# Altium schematic sheet USBhub.SchDoc
size 558 x 431 mm; SheetNumber: 1; SheetTotal: 1
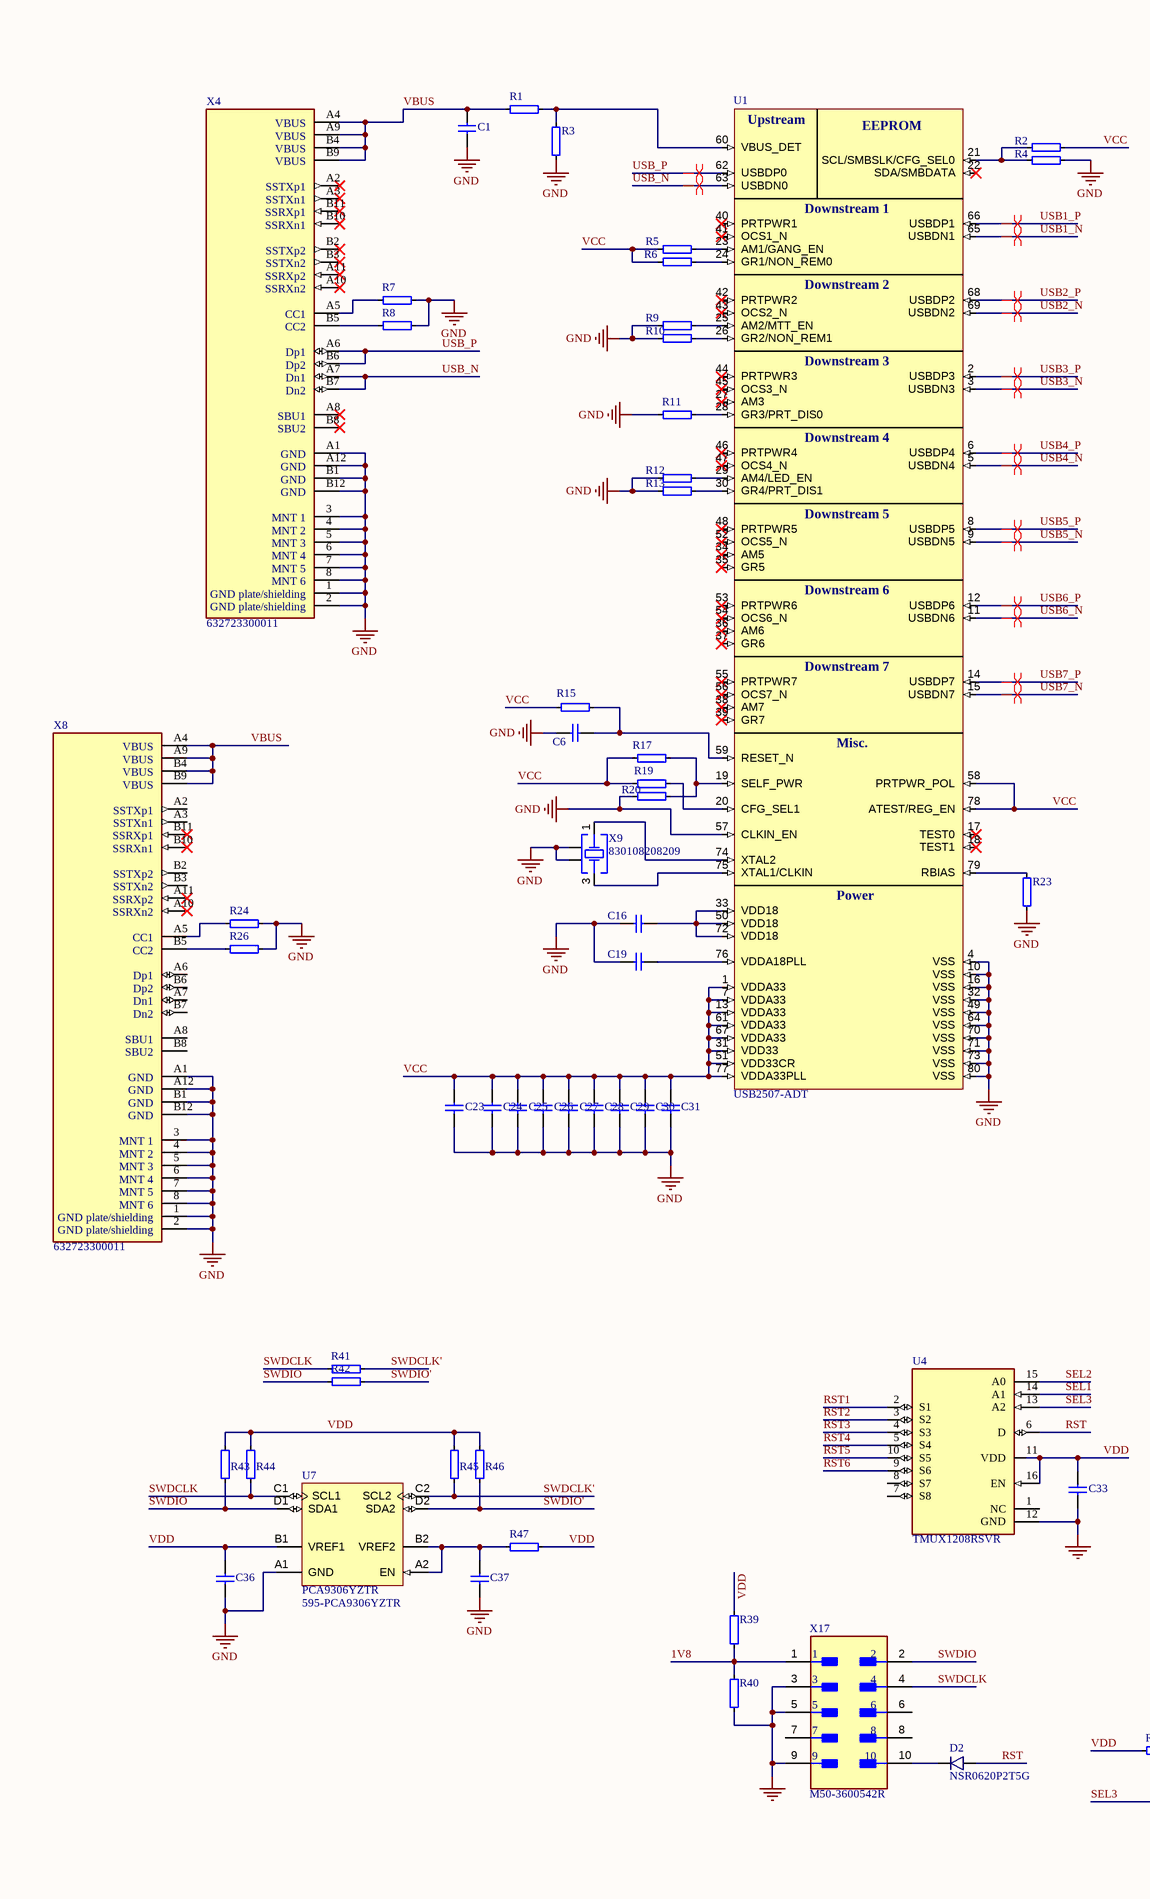
[diagram p0: USBhub.SchDoc, left]
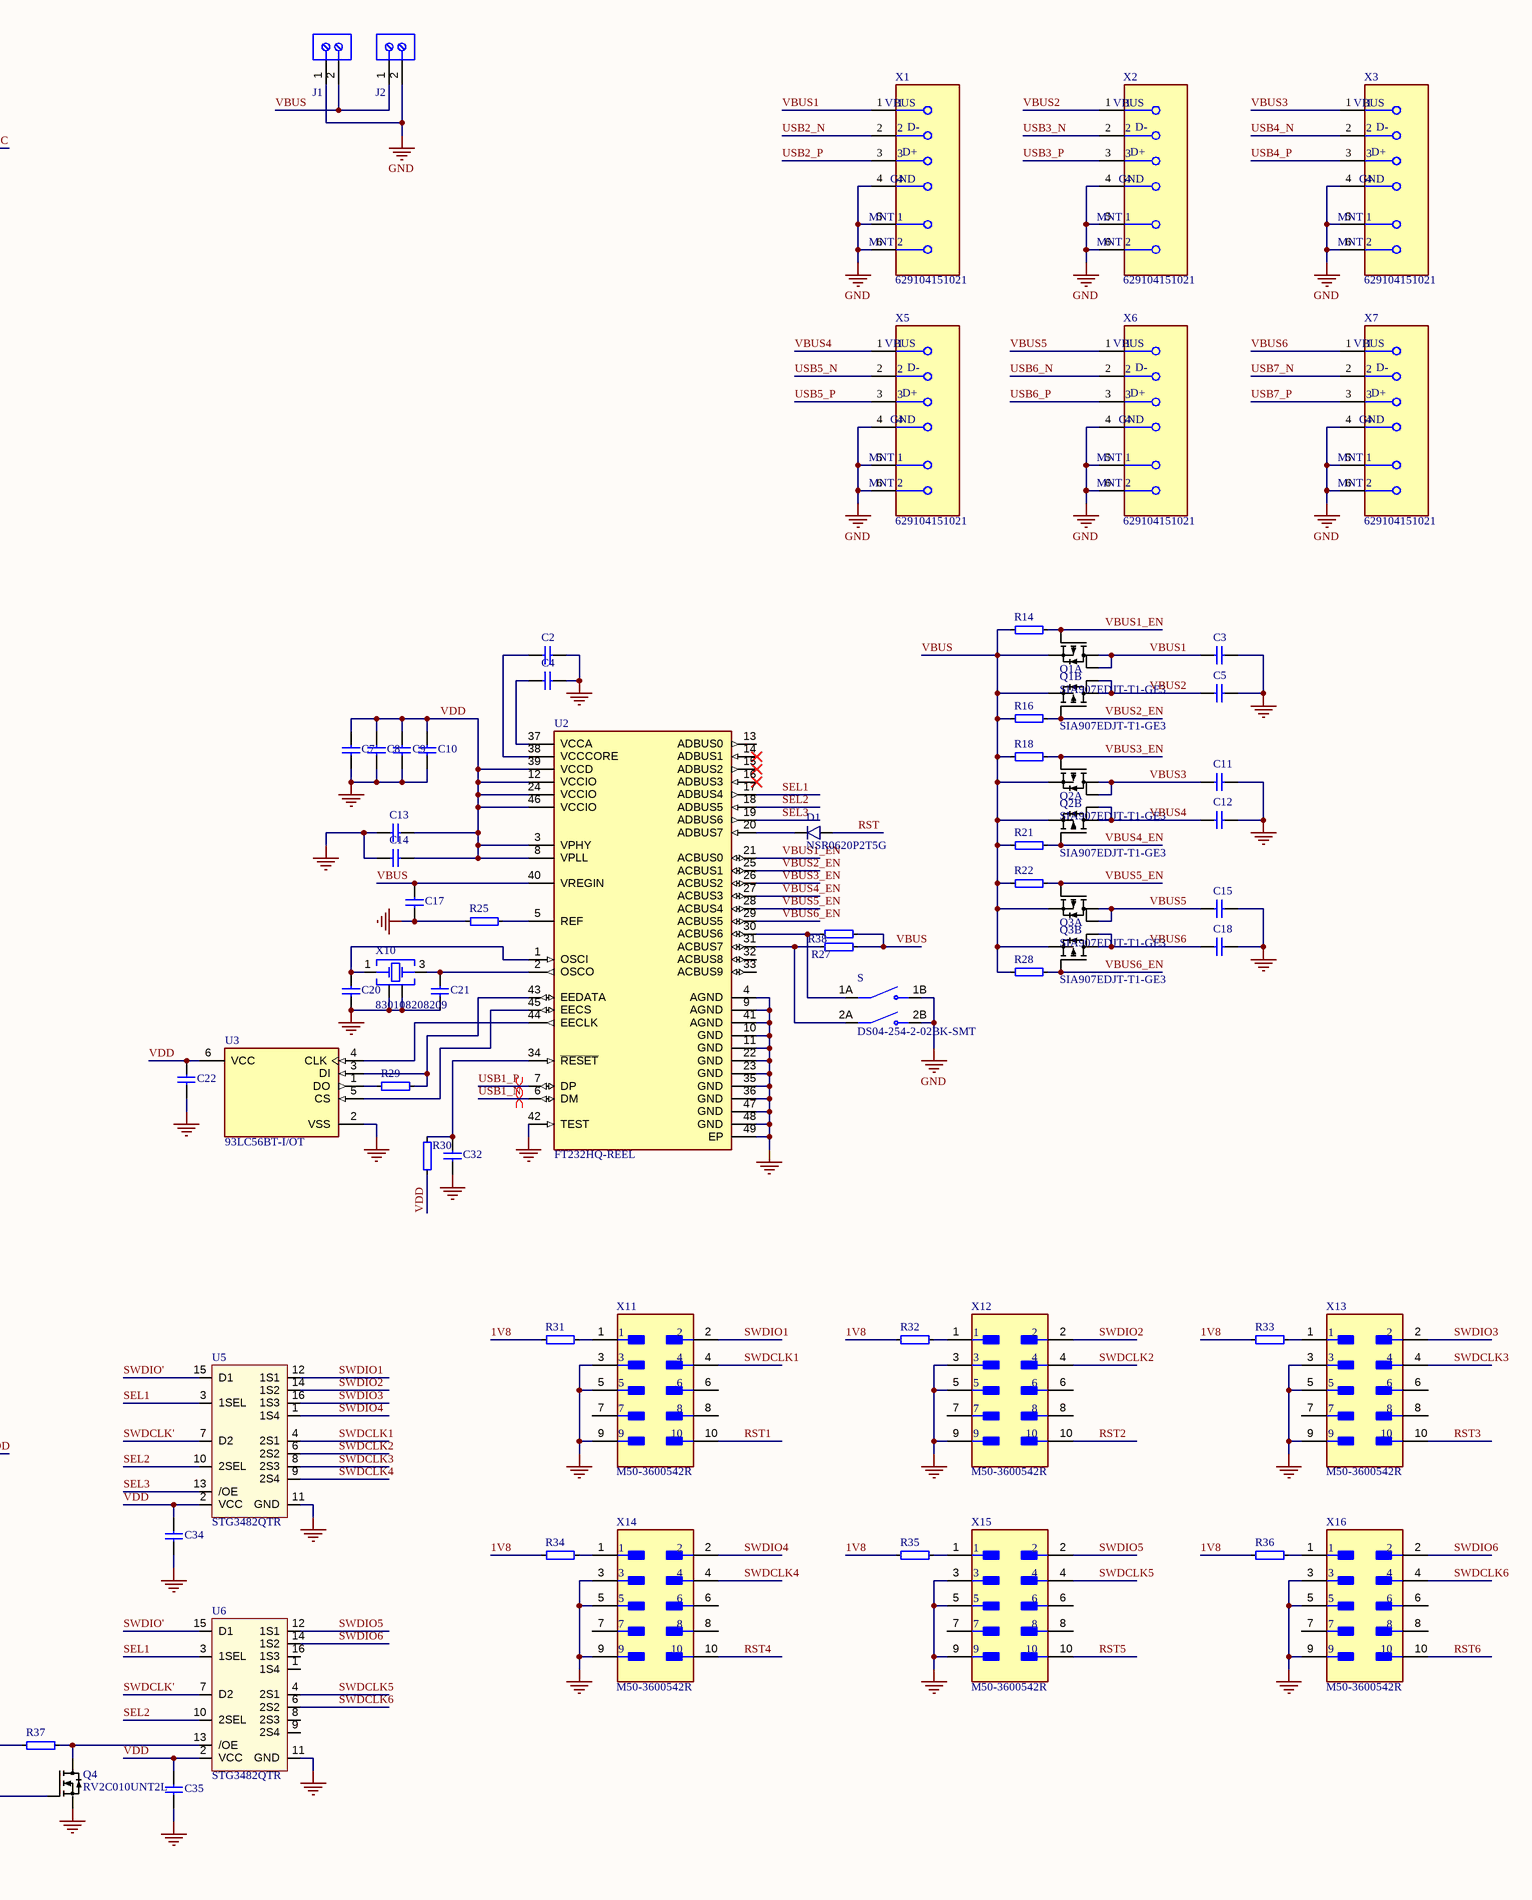
[diagram p1: USBhub.SchDoc, right]

## Parts
C1  C0402  [CAPC1005X04L]  (value not drawn)
C2  C0201  [CAPC0603X03L_C]  (value not drawn)
C3  C0402  [CAPC1005X04L]  (value not drawn)
C4  C0201  [CAPC0603X03L_C]  (value not drawn)
C5  C0402  [CAPC1005X04L]  (value not drawn)
C6  C0201  [CAPC0603X03L_C]  (value not drawn)
C7  C0201  [CAPC0603X03L_C]  (value not drawn)
C8  C0201  [CAPC0603X03L_C]  (value not drawn)
C9  C0201  [CAPC0603X03L_C]  (value not drawn)
C10  C0201  [CAPC0603X03L_C]  (value not drawn)
C11  C0402  [CAPC1005X04L]  (value not drawn)
C12  C0402  [CAPC1005X04L]  (value not drawn)
C13  C0201  [CAPC0603X03L_C]  (value not drawn)
C14  C0201  [CAPC0603X03L_C]  (value not drawn)
C15  C0402  [CAPC1005X04L]  (value not drawn)
C16  C0402  [CAPC1005X04L]  (value not drawn)
C17  C0201  [CAPC0603X03L_C]  (value not drawn)
C18  C0402  [CAPC1005X04L]  (value not drawn)
C19  C0402  [CAPC1005X04L]  (value not drawn)
C20  C0201  [CAPC0603X03L_C]  (value not drawn)
C21  C0201  [CAPC0603X03L_C]  (value not drawn)
C22  C0201  [CAPC0603X03L_C]  (value not drawn)
C23  C0603  [CAPC1608X06L]  (value not drawn)
C24  C0201  [CAPC0603X03L_C]  (value not drawn)
C25  C0201  [CAPC0603X03L_C]  (value not drawn)
C26  C0201  [CAPC0603X03L_C]  (value not drawn)
C27  C0201  [CAPC0603X03L_C]  (value not drawn)
C28  C0201  [CAPC0603X03L_C]  (value not drawn)
C29  C0201  [CAPC0603X03L_C]  (value not drawn)
C30  C0201  [CAPC0603X03L_C]  (value not drawn)
C31  C0201  [CAPC0603X03L_C]  (value not drawn)
C32  C0201  [CAPC0603X03L_C]  (value not drawn)
C33  C0201  [CAPC0603X03L_C]  (value not drawn)
C34  C0201  [CAPC0603X03L_C]  (value not drawn)
C35  C0201  [CAPC0603X03L_C]  (value not drawn)
C36  C0201  [CAPC0603X03L_C]  (value not drawn)
C37  C0201  [CAPC0603X03L_C]  (value not drawn)
D1  NSR0620P2T5G  [SODFL100X40-2N]
D2  NSR0620P2T5G  [SODFL100X40-2N]
J1  691103110002  [691103110002]  (value not drawn)
J2  691103110002  [691103110002]  (value not drawn)
Q1  SIA907EDJT-T1-GE3  [FP-C-07431-DUAL-MFG]  (parts A,B of 2)
Q2  SIA907EDJT-T1-GE3  [FP-C-07431-DUAL-MFG]  (parts A,B of 2)
Q3  SIA907EDJT-T1-GE3  [FP-C-07431-DUAL-MFG]  (parts A,B of 2)
Q4  RV2C010UNT2L  [DFN65P100X40-3L]
R1  R0201  [RESC0603X03L_C]  (value not drawn)
R2  R0201  [RESC0603X03L_C]  (value not drawn)
R3  R0201  [RESC0603X03L_C]  (value not drawn)
R4  R0201  [RESC0603X03L_C]  (value not drawn)
R5  R0201  [RESC0603X03L_C]  (value not drawn)
R6  R0201  [RESC0603X03L_C]  (value not drawn)
R7  R0201  [RESC0603X03L_C]  (value not drawn)
R8  R0201  [RESC0603X03L_C]  (value not drawn)
R9  R0201  [RESC0603X03L_C]  (value not drawn)
R10  R0201  [RESC0603X03L_C]  (value not drawn)
R11  R0201  [RESC0603X03L_C]  (value not drawn)
R12  R0201  [RESC0603X03L_C]  (value not drawn)
R13  R0201  [RESC0603X03L_C]  (value not drawn)
R14  R0201  [RESC0603X03L_C]  (value not drawn)
R15  R0201  [RESC0603X03L_C]  (value not drawn)
R16  R0201  [RESC0603X03L_C]  (value not drawn)
R17  R0201  [RESC0603X03L_C]  (value not drawn)
R18  R0201  [RESC0603X03L_C]  (value not drawn)
R19  R0201  [RESC0603X03L_C]  (value not drawn)
R20  R0201  [RESC0603X03L_C]  (value not drawn)
R21  R0201  [RESC0603X03L_C]  (value not drawn)
R22  R0201  [RESC0603X03L_C]  (value not drawn)
R23  R0201  [RESC0603X03L_C]  (value not drawn)
R24  R0201  [RESC0603X03L_C]  (value not drawn)
R25  R0201  [RESC0603X03L_C]  (value not drawn)
R26  R0201  [RESC0603X03L_C]  (value not drawn)
R27  R0201  [RESC0603X03L_C]  (value not drawn)
R28  R0201  [RESC0603X03L_C]  (value not drawn)
R29  R0201  [RESC0603X03L_C]  (value not drawn)
R30  R0201  [RESC0603X03L_C]  (value not drawn)
R31  R0201  [RESC0603X03L_C]  (value not drawn)
R32  R0201  [RESC0603X03L_C]  (value not drawn)
R33  R0201  [RESC0603X03L_C]  (value not drawn)
R34  R0201  [RESC0603X03L_C]  (value not drawn)
R35  R0201  [RESC0603X03L_C]  (value not drawn)
R36  R0201  [RESC0603X03L_C]  (value not drawn)
R37  R0201  [RESC0603X03L_C]  (value not drawn)
R38  R0201  [RESC0603X03L_C]  (value not drawn)
R39  R0201  [RESC0603X03L_C]  (value not drawn)
R40  R0201  [RESC0603X03L_C]  (value not drawn)
R41  R0201  [RESC0603X03L_C]  (value not drawn)
R42  R0201  [RESC0603X03L_C]  (value not drawn)
R43  R0201  [RESC0603X03L_C]  (value not drawn)
R44  R0201  [RESC0603X03L_C]  (value not drawn)
R45  R0201  [RESC0603X03L_C]  (value not drawn)
R46  R0201  [RESC0603X03L_C]  (value not drawn)
R47  R0201  [RESC0603X03L_C]  (value not drawn)
S  DS04-254-2-02BK-SMT  [SW_DS04-254-2-02BK-SMT]
U1  USB2507-ADT  [USB2507-ADT]
U2  FT232HQ-REEL  [FT232HQ]
U3  93LC56BT-I/OT  [93LC56BT-I/OT_sot23-6]
U4  TMUX1208RSVR  [FP-RSV0016A-MFG]
U5  STG3482QTR  [STG3482QTR]
U6  STG3482QTR  [STG3482QTR]
U7  PCA9306YZTR  Supplier Part Number 1: 595-PCA9306YZTR  [PCA9306YZTR]
X1  629104151021  [FP-629104151021-MFG]
X2  629104151021  [FP-629104151021-MFG]
X3  629104151021  [FP-629104151021-MFG]
X4  632723300011  [FP-632723300011-MFG]
X5  629104151021  [FP-629104151021-MFG]
X6  629104151021  [FP-629104151021-MFG]
X7  629104151021  [FP-629104151021-MFG]
X8  632723300011  [FP-632723300011-MFG]
X9  830108208209  [WE-XTAL_CFPX-218]
X10  830108208209  [WE-XTAL_CFPX-218]
X11  M50-3600542R  [M50-3600542R]
X12  M50-3600542R  [M50-3600542R]
X13  M50-3600542R  [M50-3600542R]
X14  M50-3600542R  [M50-3600542R]
X15  M50-3600542R  [M50-3600542R]
X16  M50-3600542R  [M50-3600542R]
X17  M50-3600542R  [M50-3600542R]

## Nets
GND: C1.1 C2.1 C3.1 C4.1 C5.1 C6.1 C7.1 C8.1 C9.1 C10.1 C11.1 C12.1 C13.2 C14.2 C15.1 C16.1 C17.1 C18.1 C19.1 C20.2 C21.2 C22.1 C23.1 C24.1 C25.1 C26.1 C27.1 C28.1 C29.1 C30.1 C31.1 C32.1 C33.1 C34.1 C35.1 C36.1 C37.1 J1.1 J2.2 Q4.2(S) R3.2 R4.2 R7.1 R8.1 R9.1 R10.1 R11.1 R12.1 R13.1 R20.1 R23.2 R24.1 R25.1 R26.1 R40.2 S.1B(NO1) S.2B(NO2) U1.4(VSS) U1.10(VSS) U1.16(VSS) U1.32(VSS) U1.49(VSS) U1.57(CLKIN_EN) U1.64(VSS) U1.70(VSS) U1.71(VSS) U1.73(VSS) U1.80(VSS) U2.4(AGND) U2.9(AGND) U2.10(GND) U2.11(GND) U2.22(GND) U2.23(GND) U2.35(GND) U2.36(GND) U2.41(AGND) U2.42(TEST) U2.47(GND) U2.48(GND) U2.49(EP) U3.2(VSS) U4.12(GND) U5.11(GND) U6.11(GND) U7.A1(GND) X1.4 X1.5(MNT_1) X1.6(MNT_2) X2.4 X2.5(MNT_1) X2.6(MNT_2) X3.4 X3.5(MNT_1) X3.6(MNT_2) X4.1(GND_plate/shielding) X4.2(GND_plate/shielding) X4.3(MNT_1) X4.4(MNT_2) X4.5(MNT_3) X4.6(MNT_4) X4.7(MNT_5) X4.8(MNT_6) X4.A1(GND) X4.A12(GND) X4.B1(GND) X4.B12(GND) X5.4 X5.5(MNT_1) X5.6(MNT_2) X6.4 X6.5(MNT_1) X6.6(MNT_2) X7.4 X7.5(MNT_1) X7.6(MNT_2) X8.1(GND_plate/shielding) X8.2(GND_plate/shielding) X8.3(MNT_1) X8.4(MNT_2) X8.5(MNT_3) X8.6(MNT_4) X8.7(MNT_5) X8.8(MNT_6) X8.A1(GND) X8.A12(GND) X8.B1(GND) X8.B12(GND) X9.2(GND) X9.4(GND) X10.2(GND) X10.4(GND) X11.3 X11.5 X11.9 X12.3 X12.5 X12.9 X13.3 X13.5 X13.9 X14.3 X14.5 X14.9 X15.3 X15.5 X15.9 X16.3 X16.5 X16.9 X17.3 X17.5 X17.9
1V8: R31.2 R32.2 R33.2 R34.2 R35.2 R36.2 R39.2 R40.1 X17.1
RST: D1.2(A) D2.2(A) U4.6(D)
RST1: U4.2(S1) X11.10
RST2: U4.3(S2) X12.10
RST3: U4.4(S3) X13.10
RST4: U4.5(S4) X14.10
RST5: U4.10(S5) X15.10
RST6: U4.9(S6) X16.10
SEL1: U2.17(ADBUS4) U4.14(A1) U5.3(1SEL) U6.3(1SEL)
SEL2: U2.18(ADBUS5) U4.15(A0) U5.10(2SEL) U6.10(2SEL)
SEL3: Q4.1(G) U2.19(ADBUS6) U4.13(A2) U5.13(/OE)
SWDCLK: R41.2 R44.1 U7.C1(SCL1) X17.4
SWDCLK1: U5.4(2S1) X11.4
SWDCLK2: U5.6(2S2) X12.4
SWDCLK3: U5.8(2S3) X13.4
SWDCLK4: U5.9(2S4) X14.4
SWDCLK5: U6.4(2S1) X15.4
SWDCLK6: U6.6(2S2) X16.4
SWDCLK': R41.1 R45.1 U5.7(D2) U6.7(D2) U7.C2(SCL2)
SWDIO: R42.2 R43.1 U7.D1(SDA1) X17.2
SWDIO1: U5.12(1S1) X11.2
SWDIO2: U5.14(1S2) X12.2
SWDIO3: U5.16(1S3) X13.2
SWDIO4: U5.1(1S4) X14.2
SWDIO5: U6.12(1S1) X15.2
SWDIO6: U6.14(1S2) X16.2
SWDIO': R42.1 R46.1 U5.15(D1) U6.15(D1) U7.D2(SDA2)
USB1_N: U1.65(USBDN1) U2.6(DM)
USB1_P: U1.66(USBDP1) U2.7(DP)
USB2_N: U1.69(USBDN2) X1.2
USB2_P: U1.68(USBDP2) X1.3
USB3_N: U1.3(USBDN3) X2.2
USB3_P: U1.2(USBDP3) X2.3
USB4_N: U1.5(USBDN4) X3.2
USB4_P: U1.6(USBDP4) X3.3
USB5_N: U1.9(USBDN5) X5.2
USB5_P: U1.8(USBDP5) X5.3
USB6_N: U1.11(USBDN6) X6.2
USB6_P: U1.12(USBDP6) X6.3
USB7_N: U1.15(USBDN7) X7.2
USB7_P: U1.14(USBDP7) X7.3
USB_N: U1.63(USBDN0) X4.A7(Dn1) X4.B7(Dn2)
USB_P: U1.62(USBDP0) X4.A6(Dp1) X4.B6(Dp2)
VBUS: C1.2 C17.2 J1.2 J2.1 Q1.1(S1) Q1.4(S2) Q2.1(S1) Q2.4(S2) Q3.1(S1) Q3.4(S2) R1.2 R14.2 R16.2 R18.2 R21.2 R22.2 R27.2 R28.2 R38.2 U2.40(VREGIN) X4.A4(VBUS) X4.A9(VBUS) X4.B4(VBUS) X4.B9(VBUS) X8.A4(VBUS) X8.A9(VBUS) X8.B4(VBUS) X8.B9(VBUS)
VBUS1: C3.2 Q1.3(D2) Q1.8(D2) X1.1
VBUS1_EN: Q1.5(G2) R14.1 U2.21(ACBUS0)
VBUS2: C5.2 Q1.6(D1) Q1.7(D1) X2.1
VBUS2_EN: Q1.2(G1) R16.1 U2.25(ACBUS1)
VBUS3: C11.2 Q2.3(D2) Q2.8(D2) X3.1
VBUS3_EN: Q2.5(G2) R18.1 U2.26(ACBUS2)
VBUS4: C12.2 Q2.6(D1) Q2.7(D1) X5.1
VBUS4_EN: Q2.2(G1) R21.1 U2.27(ACBUS3)
VBUS5: C15.2 Q3.3(D2) Q3.8(D2) X6.1
VBUS5_EN: Q3.5(G2) R22.1 U2.28(ACBUS4)
VBUS6: C18.2 Q3.6(D1) Q3.7(D1) X7.1
VBUS6_EN: Q3.2(G1) R28.1 U2.29(ACBUS5)
VCC: C23.2 C24.2 C25.2 C26.2 C27.2 C28.2 C29.2 C30.2 C31.2 R2.2 R5.1 R6.1 R15.1 R17.1 R19.1 U1.1(VDDA33) U1.7(VDDA33) U1.13(VDDA33) U1.31(VDD33) U1.51(VDD33CR) U1.58(PRTPWR_POL) U1.61(VDDA33) U1.67(VDDA33) U1.77(VDDA33PLL) U1.78(ATEST/REG_EN)
VDD: C7.2 C8.2 C9.2 C10.2 C13.1 C14.1 C22.2 C33.2 C34.2 C35.2 C36.2 R30.1 R37.2 R39.1 R43.2 R44.2 R45.2 R46.2 R47.1 U2.3(VPHY) U2.8(VPLL) U2.12(VCCIO) U2.24(VCCIO) U2.39(VCCD) U2.46(VCCIO) U3.6(VCC) U4.11(VDD) U4.16(EN) U5.2(VCC) U6.2(VCC) U7.B1(VREF1)
NetC2_2: C2.2 U2.38(VCCCORE)
NetC4_2: C4.2 U2.37(VCCA)
NetC6_2: C6.2 R15.2 U1.59(RESET_N)
NetC16_2: C16.2 U1.33(VDD18) U1.50(VDD18) U1.72(VDD18)
NetC19_2: C19.2 U1.76(VDDA18PLL)
NetC20_1: C20.1 U2.1(OSCI) X10.1(Crystal)
NetC21_1: C21.1 U2.2(OSCO) X10.3(Crystal)
NetC32_2: C32.2 R30.2 U2.34(~{RESET})
NetC37_2: C37.2 R47.2 U7.A2(EN) U7.B2(VREF2)
NetD1_1: D1.1(C) U2.20(ADBUS7)
NetD2_1: D2.1(C) X17.10
NetQ4_3: Q4.3(D) R37.1 U6.13(/OE)
NetR1_1: R1.1 R3.1 U1.60(VBUS_DET)
NetR2_1: R2.1 R4.1 U1.21(SCL/SMBSLK/CFG_SEL0)
NetR5_2: R5.2 U1.23(AM1/GANG_EN)
NetR6_2: R6.2 U1.24(GR1/NON_REM0)
NetR7_2: R7.2 X4.A5(CC1)
NetR8_2: R8.2 X4.B5(CC2)
NetR9_2: R9.2 U1.25(AM2/MTT_EN)
NetR10_2: R10.2 U1.26(GR2/NON_REM1)
NetR11_2: R11.2 U1.28(GR3/PRT_DIS0)
NetR12_2: R12.2 U1.29(AM4/LED_EN)
NetR13_2: R13.2 U1.30(GR4/PRT_DIS1)
NetR17_2: R17.2 R20.2 U1.19(SELF_PWR)
NetR19_2: R19.2 U1.20(CFG_SEL1)
NetR23_1: R23.1 U1.79(RBIAS)
NetR24_2: R24.2 X8.A5(CC1)
NetR25_2: R25.2 U2.5(REF)
NetR26_2: R26.2 X8.B5(CC2)
NetR27_1: R27.1 S.2A(COM2) U2.31(ACBUS7)
NetR29_1: R29.1 U3.1(DO)
NetR29_2: R29.2 U2.43(EEDATA) U3.3(DI)
NetR31_1: R31.1 X11.1
NetR32_1: R32.1 X12.1
NetR33_1: R33.1 X13.1
NetR34_1: R34.1 X14.1
NetR35_1: R35.1 X15.1
NetR36_1: R36.1 X16.1
NetR38_1: R38.1 S.1A(COM1) U2.30(ACBUS6)
NetU1_74: U1.74(XTAL2) X9.1(Crystal)
NetU1_75: U1.75(XTAL1/CLKIN) X9.3(Crystal)
NetU2_44: U2.44(EECLK) U3.4(CLK)
NetU2_45: U2.45(EECS) U3.5(CS)

Not connected (* = marked no-connect by the designer): U1 17(TEST0)* 18(TEST1)* 22(SDA/SMBDATA)* 27(AM3)* 34(AM5)* 35(GR5)* 36(AM6)* 37(GR6)* 38(AM7)* 39(GR7)* 40(PRTPWR1)* 41(OCS1_N)* 42(PRTPWR2)* 43(OCS2_N)* 44(PRTPWR3)* 45(OCS3_N)* 46(PRTPWR4)* 47(OCS4_N)* 48(PRTPWR5)* 52(OCS5_N)* 53(PRTPWR6)* 54(OCS6_N)* 55(PRTPWR7)* 56(OCS7_N)*; U2 13(ADBUS0) 14(ADBUS1)* 15(ADBUS2)* 16(ADBUS3)* 32(ACBUS8) 33(ACBUS9); U4 1(NC) 7(S8) 8(S7); U6 1(1S4) 8(2S3) 9(2S4) 16(1S3); X4 A2(SSTXp1)* A3(SSTXn1)* A8(SBU1)* A10(SSRXn2)* A11(SSRXp2)* B2(SSTXp2)* B3(SSTXn2)* B8(SBU2)* B10(SSRXn1)* B11(SSRXp1)*; X8 A2(SSTXp1) A3(SSTXn1) A6(Dp1) A7(Dn1) A8(SBU1) A10(SSRXn2)* A11(SSRXp2)* B2(SSTXp2) B3(SSTXn2) B6(Dp2) B7(Dn2) B8(SBU2) B10(SSRXn1)* B11(SSRXp1)*; X11 6 7 8; X12 6 7 8; X13 6 7 8; X14 6 7 8; X15 6 7 8; X16 6 7 8; X17 6 7 8

## Layout directives
differential pair: USB1_N, USB1_P
differential pair; differential pair class usbDif: USB1_N, USB1_P, USB2_N, USB2_P, USB3_N, USB3_P, USB4_N, USB4_P, USB5_N, USB5_P, USB6_N, USB6_P, USB7_N, USB7_P, USB_N, USB_P

## Notes on the sheet
- DWG. NO.
- REV.
- SHT.
- REVISION
- DESCRIPTION
- DATE
- APPROVED
- THIS DOCUMENT AND THE DATA DISCLOSED HEREIN OR HEREWITH IS THE PROPERTY OF ALTIUM LIMITED AND MAY BE FREELY DISTRIBUTED IN WHOLE. NO RIGHTS ARE RESERVED OR EXPRESS OR IMPLIED WARANTEE GIVEN.
- ENG:
- DSN:
- APPROVALS
- PROJECT
- DOCUMENT REVISION:
- DESIGN ITEM:
- CHK:
- BOM:
- REFERENCE DOCUMENTS
- PROJECT REVISION:
- TITLE
- FAB DWG:
- PCB DWG:
- ASSY DWG:
- SCALE:
- SIZE
- C
- CAGE CODE
- FILE NAME
- DWG NO.
- SHEET
- OF
- REV
- (in symbol 629104151021) VBUS; D-; D+; GND
- (in symbol USB2507-ADT) Upstream; EEPROM; Downstream 1; Downstream 2; Downstream 3; Downstream 4; Downstream 5; Downstream 6; Downstream 7; Misc.; Power

## Library data of the parts
D1 D2 = NSR0620P2T5G: 20V schottky barrier diode, Vf 350 mV @ 100 mA, Ir 2.0 µA @ 10 V, If 500 mA; Manufacturer: ON Semiconductor; Part number IPS: 00000009952; Note: N.A.; Artikkelnr Noca: 10029169; Pad Count: 2; Part Number: NSR0620P2T5G; Manufacturer Part Number: NSR0620P2T5G; LatestRevisionDate: 2016-07-07; Published: 2016-07-07; Value: NSR0620P2T5G; Footprint Doc: SOD-923; ComponentLink1URL: N.A.; ComponentLink1Description: Datasheet; ComponentLink2URL: N.A.; ComponentLink2Description: Supplier link; HelpURL: http://www.onsemi.com/pub_link/Collateral/NSR0620P2-D.PDF; Supplier 1: Digi-Key; Supplier Part Number 1: NSR0620P2T5GOSCT-ND; Supplier 2: N.A.; Supplier Part Number 2: N.A.; Component Class: Semiconductors; PartId: 101300131
J1 J2 = 691103110002: WR-TBL Series 1031 Horizontal Entry Modular, Through Hole, pitch 3.5mm, 2p; Manufacturer: Wurth Elektronik; Pin Number: 2; Rated Current: 10A; Working Voltage: 125V; PCB/Cable/Panel: PCB; Modularity: Yes; ComponentLink1Description: Manufacturer Link; ComponentLink1URL: https://www.we-online.com/redexpert/article/691103110002?ad; ComponentLink2Description: Datasheet; ComponentLink2URL: https://www.we-online.com/redexpert/spec/691103110002?ad; Category: Terminal Blocks; Match Code: WR-TBL; Manufacturer Part Number: 691103110002; Mount: Through Hole; Operating Temperature Max: 105°C; Operating Temperature Min: -40°C; Packaging: Box; Pitch: 3.5mm; Orientation: Horizontal; Application: Pressure Clamp
Q1-Q3 = SIA907EDJT-T1-GE3: SiA907EDJT Series Dual P Channel 20 V 0.057 Ohm 7.8 W Mosfet - PowerPAK SC-70-6L; Manufacturer: Vishay Siliconix; Rds On Max: 57mR; Rise Time: 10ns; Drain to Source Voltage (Vdss): 20V; Continuous Drain Current (ID): 4.5A; Max Power Dissipation: 7.8W; Gate to Source Voltage (Vgs): 12V; Turn-Off Delay Time: 30ns; Number of Elements: 2; Power Dissipation: 1.9W; Turn-On Delay Time: 5ns; Drain to Source Breakdown Voltage: -20V; Polarity: P-CHANNEL; Supplier 1: Mouser; Manufacturer Part Number: SIA907EDJT-T1-GE3; RoHS: Yes; Category: MOSFETs; Stock 1: 2602; Pricing 1: 1=0.57000, 10=0.49500, 50=0.49500, 100=0.37000, 500=0.29100, 1000=0.22500, 3000=0.20400, 6000=0.19100, 9000=0.18500, 10000=0.18500 (USD); Mount: Surface Mount; Number of Pins: 6; Weight: 0.000988oz; Min Operating Temperature: -55°C; Max Operating Temperature: 150°C; Packaging: Tape and Reel; Package Quantity: 3000; Drain to Source Resistance: 57mR; Fall Time: 10ns; Number of Channels: 2; On-State Resistance: 57mR; Element Configuration: Dual; Series: TrenchFET®; Drain-source On Resistance-Max: 57mR; Radiation Hardening: No; Lead Free: Contains Lead; RoHS Compliant: Yes; ComponentLink1URL: https://datasheet.ciiva.com/4444/sia907edjt-223688-4444605.pdf?src-supplier=Mouser; ComponentLink1Description: https://datasheet.ciiva.com/4444/sia907edjt-223688-4444605.pdf?src-supplier=Mouser; ComponentLink2URL: https://datasheet.ciiva.com/30021/sia907edjt-30021591.pdf?src-supplier=Avnet; ComponentLink2Description: https://datasheet.ciiva.com/30021/sia907edjt-30021591.pdf?src-supplier=Avnet; Supplier Part Number 1: 78-SIA907EDJT-T1-GE3
Q4 = RV2C010UNT2L: MOSFET Transistor, N Channel, 1 A, 20 V, 0.34 ohm, 4.5 V, 1 V RoHS Compliant: Yes; Manufacturer: Rohm; Drain to Source Voltage (Vdss): 20V; Continuous Drain Current (ID): 1A; Rds On Max: 470mR; Input Capacitance: 40pF; Max Power Dissipation: 400mW; Threshold Voltage: 1V; Resistance: 0.34R; Supplier 1: Mouser; Manufacturer Part Number: RV2C010UNT2L; RoHS: Yes; Category: MOSFETs; Stock 1: 3031; Pricing 1: 1=0.39000, 10=0.25100, 50=0.25100, 100=0.16500, 500=0.10900, 1000=0.08400, 2500=0.07700, 10000=0.07700 (USD); Mount: Surface Mount; Number of Pins: 1006; Max Operating Temperature: 150°C; Packaging: Cut Tape; REACH SVHC: No SVHC; RoHS Compliant: Yes; ComponentLink1URL: http://www.farnell.com/datasheets/1945594.pdf?src-supplier=Farnell; ComponentLink1Description: http://www.farnell.com/datasheets/1945594.pdf?src-supplier=Farnell; ComponentLink2URL: http://www.mouser.com/ds/2/348/rv2c010un-e-1139137.pdf?src-supplier=Mouser; ComponentLink2Description: http://www.mouser.com/ds/2/348/rv2c010un-e-1139137.pdf?src-supplier=Mouser; ComponentLink3URL: http://rohmfs.rohm.com/en/techdata_basic/transistor/taping/VML1006_T2L_taping.pdf?src-supplier=Digi-Key; ComponentLink3Description: http://rohmfs.rohm.com/en/techdata_basic/transistor/taping/VML1006_T2L_taping.pdf?src-supplier=Digi-Key; ComponentLink4URL: http://www.rohm.com/web/global/datasheet/RV2C010UN/rv2c010un-e?src-supplier=Digi-Key; ComponentLink4Description: http://www.rohm.com/web/global/datasheet/RV2C010UN/rv2c010un-e?src-supplier=Digi-Key; ComponentLink5URL: http://rohmfs.rohm.com/en/products/databook/datasheet/discrete/transistor/mosfet/rv2c010unt2l.pdf?src-supplier=Avnet; ComponentLink5Description: http://rohmfs.rohm.com/en/products/databook/datasheet/discrete/transistor/mosfet/rv2c010unt2l.pdf?src-supplier=Avnet; ComponentLink6URL: http://www.farnell.com/datasheets/1945594.pdf?src-supplier=Element14; ComponentLink6Description: http://www.farnell.com/datasheets/1945594.pdf?src-supplier=Element14; Supplier Part Number 1: 755-RV2C010UNT2L
S = DS04-254-2-02BK-SMT: 2 Pole, Flat Actuator, Flat Bottom, SMT Pin, DIP Switch; MF: CUI Devices; SnapEDA_Link: https://www.snapeda.com/parts/DS04-254-2-02BK-SMT/CUI%20Devices/view-part/4467284/?ref=snap; Price: None; Value: *; Availability: Unavailable; Package: None; MP: DS04-254-2-02BK-SMT
U1 = USB2507-ADT: Low Speed/Full Speed/High Speed Compatible 7 Port Hub USB 2.0 1.8V/3.3V Tray 80-Pin TQFP; Manufacturer: Microchip; Data Rate: 480Mbps; Nominal Supply Current: 360mA; Min Supply Voltage: 3V; Max Supply Voltage: 3.6V; Number of Transceivers: 3; Interface: USB,I2C,Serial; Operating Supply Voltage: 3.3V; Operating Supply Current: 100mA; Number of Ports: 7; Supplier 1: Arrow Electronics; Manufacturer Part Number: USB2507-ADT; RoHS: Yes; Category: Integrated Circuits (ICs); Stock 1: 130; Pricing 1: 1=7.41290 (USD); Mount: Surface Mount; Case/Package: TQFP; Number of Pins: 80; Contact Plating: Tin,Matte; Min Operating Temperature: 0°C; Max Operating Temperature: 70°C; Packaging: Tray; Package Quantity: 119; Termination: SMD/SMT; Dual Supply Voltage: 3.3V; Number of Channels: 7; Series: -; Supply Current: 360mA; Length: 12mm; Width: 12mm; Height: 1.4mm; Radiation Hardening: No; Lead Free: Lead Free; REACH SVHC: No SVHC; RoHS Compliant: Yes; ComponentLink1URL: https://datasheet.ciiva.com/41459/001086006-da-01-en-ic-hub-7port-usb-usb2507-adt-tqfp-80-mcp-41459381.pdf?src-supplier=Conrad; ComponentLink1Description: https://datasheet.ciiva.com/41459/001086006-da-01-en-ic-hub-7port-usb-usb2507-adt-tqfp-80-mcp-41459381.pdf?src-supplier=Conrad; ComponentLink2URL: https://datasheet.ciiva.com/6636/2507-6636631.pdf?src-supplier=Digi-Key; ComponentLink2Description: https://datasheet.ciiva.com/6636/2507-6636631.pdf?src-supplier=Digi-Key; Supplier Part Number 1: USB2507-ADT
U2 = FT232HQ-REEL: Full Speed/High Speed USB Interface Device USB 2.0 3.3V T/R 48-Pin QFN EP; Manufacturer: FTDI; Data Rate: 12Mbps; Interface: UART; Number of Channels: 1; Max Supply Voltage: 3.63V; Min Supply Voltage: 2.97V; Nominal Supply Current: 60mA; Operating Supply Current: 24mA; Supplier 1: Mouser; Manufacturer Part Number: FT232HQ-REEL; RoHS: Yes; Category: Interface ICs; Pricing 1: 1=4.52000, 10=4.34000, 50=3.93000, 100=3.82000, 250=3.73000, 500=3.68000, 1000=3.56000, 6000=3.55000, 10000=3.09000 (USD); Mount: Surface Mount; Case/Package: QFN; Number of Pins: 48; Weight: 0.005309oz; Min Operating Temperature: -40°C; Max Operating Temperature: 85°C; Packaging: Tape and Reel; Package Quantity: 1; Operating Supply Voltage: 3.3V; Supply Current: 60mA; Series: -; Length: 7mm; Width: 7mm; Height: 1.4mm; Radiation Hardening: No; Lead Free: Lead Free; RoHS Compliant: Yes; REACH SVHC: No SVHC; ComponentLink1URL: https://datasheet.ciiva.com/4787/ds-ft232h-11324-4787568.pdf?src-supplier=Mouser; ComponentLink1Description: https://datasheet.ciiva.com/4787/ds-ft232h-11324-4787568.pdf?src-supplier=Mouser; ComponentLink2URL: https://datasheet.ciiva.com/7661/ds-ft232h-7661547.pdf?src-supplier=Element14; ComponentLink2Description: https://datasheet.ciiva.com/7661/ds-ft232h-7661547.pdf?src-supplier=Element14; ComponentLink3URL: https://datasheet.ciiva.com/1787/ds-ft232h-1787045.pdf?src-supplier=Digi-Key; ComponentLink3Description: https://datasheet.ciiva.com/1787/ds-ft232h-1787045.pdf?src-supplier=Digi-Key; ComponentLink4URL: https://datasheet.ciiva.com/1787/ds-ft232h-1787044.pdf?src-supplier=Digi-Key; ComponentLink4Description: https://datasheet.ciiva.com/1787/ds-ft232h-1787044.pdf?src-supplier=Digi-Key; ComponentLink5URL: https://datasheet.ciiva.com/1787/ds-ft232h-1787046.pdf?src-supplier=Digi-Key; ComponentLink5Description: https://datasheet.ciiva.com/1787/ds-ft232h-1787046.pdf?src-supplier=Digi-Key; Supplier Part Number 1: 895-FT232HQ-REEL
U3 = 93LC56BT-I/OT: RES 1 OHM 1/2W 5% AXIAL; Manufacturer: Microchip; Density: 2Kb; Max Supply Voltage: 5.5V; Min Supply Voltage: 2.5V; Interface: MICROWIRE,Serial; Max Frequency: 2MHz; Organization: 128X16; Access Time: 250ns; Nominal Supply Current: 2mA; Memory Type: EEPROM; Write Protection: YES; Write Cycle Time-Max (tWC): 6ms; Supplier 1: Mouser; Manufacturer Part Number: 93LC56BT-I/OT; RoHS: No; Category: EEPROM; Pricing 1: 1=0.32000, 10=0.32000, 50=0.32000, 100=0.32000, 1000=0.32000, 10000=0.32000 (USD); Mount: Surface Mount; Case/Package: SOT-23; Number of Pins: 6; Contact Plating: Tin,Matte; Min Operating Temperature: -40°C; Max Operating Temperature: 85°C; Packaging: Tape and Reel; Package Quantity: 3000; Memory Size: 2Kb; Frequency: 2MHz; Access Time-Max: 250ns; Supply Current: 2mA; Supply Voltage-Nom: 5.5V; Length: 3.1mm; Width: 1.8mm; Height: 1.3mm; Radiation Hardening: No; REACH SVHC: No SVHC; Lead Free: Lead Free; ComponentLink1URL: https://datasheet.ciiva.com/3185/jp013939-3185519.pdf?src-supplier=Avnet; ComponentLink1Description: https://datasheet.ciiva.com/3185/jp013939-3185519.pdf?src-supplier=Avnet; ComponentLink2URL: https://datasheet.ciiva.com/16216/filehandler-aspxddocname-en013939-16216574.pdf?src-supplier=Future+Electronics; ComponentLink2Description: https://datasheet.ciiva.com/16216/filehandler-aspxddocname-en013939-16216574.pdf?src-supplier=Future+Electronics; ComponentLink3URL: https://datasheet.ciiva.com/48496/jp013939-48496476.pdf?src-supplier=Avnet; ComponentLink3Description: https://datasheet.ciiva.com/48496/jp013939-48496476.pdf?src-supplier=Avnet; Supplier Part Number 1: 579-93LC56BT-I/OT
U4 = TMUX1208RSVR: 5-V, 8: 1, 1-channel general-purpose analog multiplexer with 1.8-V input logic 16-UQFN -40 to 125; Manufacturer: Texas Instruments; Supplier 1: Mouser; Manufacturer Part Number: TMUX1208RSVR; RoHS: Yes; Category: Decoders and Multiplexers; Stock 1: 2067; Pricing 1: 1=0.97000, 10=0.84700, 50=0.84700, 100=0.64900, 250=0.60300, 500=0.51400, 1000=0.41100, 3000=0.37200, 10000=0.37200 (USD); RoHS Compliant: Yes; ComponentLink1URL: http://www.ti.com/general/docs/suppproductinfo.tsp?distId=10&amp;gotoUrl=http%3A%2F%2Fwww.ti.com%2Flit%2Fgpn%2Ftmux1208&src-supplier=Digi-Key; ComponentLink1Description: http://www.ti.com/general/docs/suppproductinfo.tsp?distId=10&amp;gotoUrl=http%3A%2F%2Fwww.ti.com%2Flit%2Fgpn%2Ftmux1208&src-supplier=Digi-Key; Supplier Part Number 1: 595-TMUX1208RSVR
U5 U6 = STG3482QTR: Low Voltage Dual SP4T Switch with Break-Before-Make Feat.; Manufacturer: STMicroelectronics; Max Power Dissipation: 1.12W; Max Supply Voltage: 4.3V; Min Supply Voltage: 1.65V; Number of Inputs: 2; Number of Outputs: 8; On-State Resistance: 6.5R; Turn-On Delay Time: 37ns; Turn-Off Delay Time: 23ns; Max Supply Current: 100nA; Supply Type: Single; Bandwidth: 300MHz; Supplier 1: Mouser; Manufacturer Part Number: STG3482QTR; RoHS: Yes; Category: Decoders and Multiplexers; Stock 1: 1150; Pricing 1: 1=1.65000, 10=1.49000, 50=1.41000, 100=1.16000, 1000=0.75900, 10000=0.75800 (USD); Mount: Surface Mount; Case/Package: QFN; Number of Pins: 16; Min Operating Temperature: -40°C; Max Operating Temperature: 85°C; Packaging: Tape and Reel; Package Quantity: 1; Number of Channels: 2; Operating Supply Current: 100nA; Power Dissipation: 1.12W; Series: -; Radiation Hardening: No; Lead Free: Lead Free; RoHS Compliant: Yes; ComponentLink1URL: https://datasheet.ciiva.com/4919/cd00146130-114700-4919088.pdf?src-supplier=Mouser; ComponentLink1Description: https://datasheet.ciiva.com/4919/cd00146130-114700-4919088.pdf?src-supplier=Mouser; ComponentLink2URL: https://datasheet.ciiva.com/11579/cd00146130-11579527.pdf?src-supplier=Avnet; ComponentLink2Description: https://datasheet.ciiva.com/11579/cd00146130-11579527.pdf?src-supplier=Avnet; ComponentLink3URL: https://datasheet.ciiva.com/1688/cd00146130-1688941.pdf?src-supplier=Digi-Key; ComponentLink3Description: https://datasheet.ciiva.com/1688/cd00146130-1688941.pdf?src-supplier=Digi-Key; ComponentLink4URL: https://datasheet.ciiva.com/1688/cd00146130-1688942.pdf?src-supplier=Digi-Key; ComponentLink4Description: https://datasheet.ciiva.com/1688/cd00146130-1688942.pdf?src-supplier=Digi-Key; ComponentLink5URL: https://datasheet.ciiva.com/1688/cd00146130-1688943.pdf?src-supplier=Digi-Key; ComponentLink5Description: https://datasheet.ciiva.com/1688/cd00146130-1688943.pdf?src-supplier=Digi-Key; Supplier Part Number 1: 511-STG3482QTR
U7 = PCA9306YZTR: PCA9306 2-BIT Bidirectional I2C; Manufacturer: Texas Instruments; On-Chip Power-on-Reset: No; Vcc range(V): 0 to 5.5; 5V Tolerant I/O: Yes; Function: Voltage Translator; Max Frequency(kHz): 400; SubFamily: I2C Special Function; No. of Outputs: 2; Eco-Plan: Green (RoHS & no Sb/Br); tpd max(ns): 1.5; Rating: Catalog; Min Supply Voltage: 1.2V; Max Supply Voltage: 5.5V; Propagation Delay: 0.3ns; Logic Function: Translator; ComponentLink2Description: Package Specification; PackageVersion: revF, Oct-2006; Mounting Technology: Surface Mount; Open Drain I/O Type: Yes; PackageReference: YZT8; PackageDescription: 8-Ball Die-Size Ball Grid Array, 1.9 x 0.9 mm Body, 0.5 mm Pitch, Pb-Free; ComponentLink1URL: http://www.ti.com/general/docs/lit/getliterature.tsp?genericPartNumber=PCA9306&fileType=pdf; ComponentLink2URL: http://www.ti.com/litv/pdf/mpds049b; DatasheetVersion: SCPS113J; fSCLK(Max)(MHz): 400; Enable Pin: Yes; ComponentLink1Description: Datasheet; PartNumber: PCA9306YZTR; Supplier 1: Mouser; Manufacturer Part Number: PCA9306YZTR; RoHS: Yes; Category: Voltage Level Shifters; Pricing 1: 1=0.97000, 10=0.87600, 25=0.83100, 50=0.83100, 100=0.68300, 250=0.63900, 500=0.56400, 1000=0.44600, 10000=0.44600 (USD); Number of Pins: 8; Weight: 8.1E-05oz; Contact Plating: Copper,Tin,Silver; Min Operating Temperature: -40°C; Max Operating Temperature: 85°C; Package Quantity: 3000; Number of Channels: 2; Packaging: Tape and Reel; Number of Bits: 2; Output Type: I2C; Series: -; Number of Outputs: 2; REACH SVHC: No SVHC; Lead Free: Lead Free; RoHS Compliant: Yes; ComponentLink3URL: https://datasheet.ciiva.com/1504/1862428-1504150.pdf?src-supplier=Element14; ComponentLink3Description: https://datasheet.ciiva.com/1504/1862428-1504150.pdf?src-supplier=Element14; ComponentLink4URL: https://datasheet.ciiva.com/1899/pca9306-1899336.pdf?src-supplier=Digi-Key; ComponentLink4Description: https://datasheet.ciiva.com/1899/pca9306-1899336.pdf?src-supplier=Digi-Key; ComponentLink5URL: https://datasheet.ciiva.com/1899/pca9306-1899335.pdf?src-supplier=Digi-Key; ComponentLink5Description: https://datasheet.ciiva.com/1899/pca9306-1899335.pdf?src-supplier=Digi-Key; ComponentLink6URL: https://datasheet.ciiva.com/1899/pca9306-1899337.pdf?src-supplier=Digi-Key; ComponentLink6Description: https://datasheet.ciiva.com/1899/pca9306-1899337.pdf?src-supplier=Digi-Key
X1-X3 X5-X7 = 629104151021: USB 2.0 Type A Receptacle WR-COM, Horizontal, SMT, with Pegs; Manufacturer: Wurth Electronics; Number of Contacts: 4; USB Standard: USB 2.0; Supplier 1: Mouser; Manufacturer Part Number: 629104151021; RoHS: Yes; Category: Connectors; Stock 1: 3535; Pricing 1: 1=2.61000, 10=2.61000, 50=2.39000, 100=2.14000, 300=1.88000, 600=1.87000, 1000=1.87000, 10000=1.87000 (USD); Mount: Surface Mount,Horizontal; Contact Material: Copper Alloy; Contact Plating: Gold; Packaging: Tape and Reel; Connector Type: USB; Gender: Receptacle; Termination: SMD/SMT; Orientation: Right Angle; Features: Shielded; REACH SVHC: Unknown; RoHS Compliant: Yes; ComponentLink1URL: https://datasheet.ciiva.com/48416/629104151021-48416055.pdf?src-supplier=Distrelec; ComponentLink1Description: https://datasheet.ciiva.com/48416/629104151021-48416055.pdf?src-supplier=Distrelec; Supplier Part Number 1: 710-629104151021
X4 X8 = 632723300011: Conn USB 3.1 Type C RCP 24 POS 0.5mm/0.4mm Solder RA SMD/Thru-Hole 24 Terminal 1 Port T/R; Manufacturer: Wurth Electronics; Number of Contacts: 24; Gender: Receptacle; Supplier 1: Mouser; Manufacturer Part Number: 632723300011; RoHS: Yes; Category: Connectors; Stock 1: 33020; Pricing 1: 1=4.37000, 10=4.06000, 50=3.42000, 100=3.15000, 700=2.72000, 1000=2.72000, 1400=2.71000, 10000=2.71000 (USD); Mount: Surface Mount,Through Hole; Packaging: Tape and Reel; Connector Type: USB; RoHS Compliant: Yes; ComponentLink1URL: https://www.mouser.com/ds/2/445/632723x00011-782157.pdf?src-supplier=Mouser; ComponentLink1Description: https://www.mouser.com/ds/2/445/632723x00011-782157.pdf?src-supplier=Mouser; ComponentLink2URL: https://katalog.we-online.de/em/datasheet/632723x00011.pdf?src-supplier=Digi-Key; ComponentLink2Description: https://katalog.we-online.de/em/datasheet/632723x00011.pdf?src-supplier=Digi-Key; Supplier Part Number 1: 710-632723300011
X9 X10 = 830108208209: Manufacturer: Wurth Electronics; Supplier 1: Mouser; Manufacturer Part Number: 830108208209; RoHS: No; Stock 1: 80; Pricing 1: 1=0.65000, 10=0.59800, 50=0.57200, 100=0.54600, 1000=0.46800, 10000=0.41600 (USD); Supplier Part Number 1: 710-830108208209
X11-X17 = M50-3600542R: Conn Unshrouded Header M 10 POS 1.27mm Solder ST Top Entry SMD T/R; Manufacturer: Harwin; Number of Contacts: 10; Max Current Rating: 1A; Contact Resistance: 30mR; Gender: Male; Supplier 1: Mouser; Manufacturer Part Number: M50-3600542R; RoHS: Yes; Category: Headers and Wire Housings; Stock 1: 26649; Pricing 1: 1=1.46000, 10=1.22000, 50=1.22000, 100=1.08000, 500=0.92400, 800=0.82600, 1000=0.82600, 2400=0.77100, 4800=0.74700, 9600=0.73900, 10000=0.73900, 24800=0.70200 (USD); Contact Plating: Gold; Contact Material: Copper Alloy; Housing Material: Thermoplastic; Min Operating Temperature: -40°C; Max Operating Temperature: 105°C; Number of Rows: 2; Termination: Solder; Orientation: Straight; Length: 6.35mm; Pitch: 1.27mm; Depth: 3.41mm; Radiation Hardening: No; RoHS Compliant: Yes; ComponentLink1URL: http://www.harwin.com/include/downloads/pdfs/2010PAGE95.PDF?src-supplier=Avnet; ComponentLink1Description: http://www.harwin.com/include/downloads/pdfs/2010PAGE95.PDF?src-supplier=Avnet; Supplier Part Number 1: 855-M50-3600542R